# EAGLE schematic cpu_board (EAGLE 7.2.0)
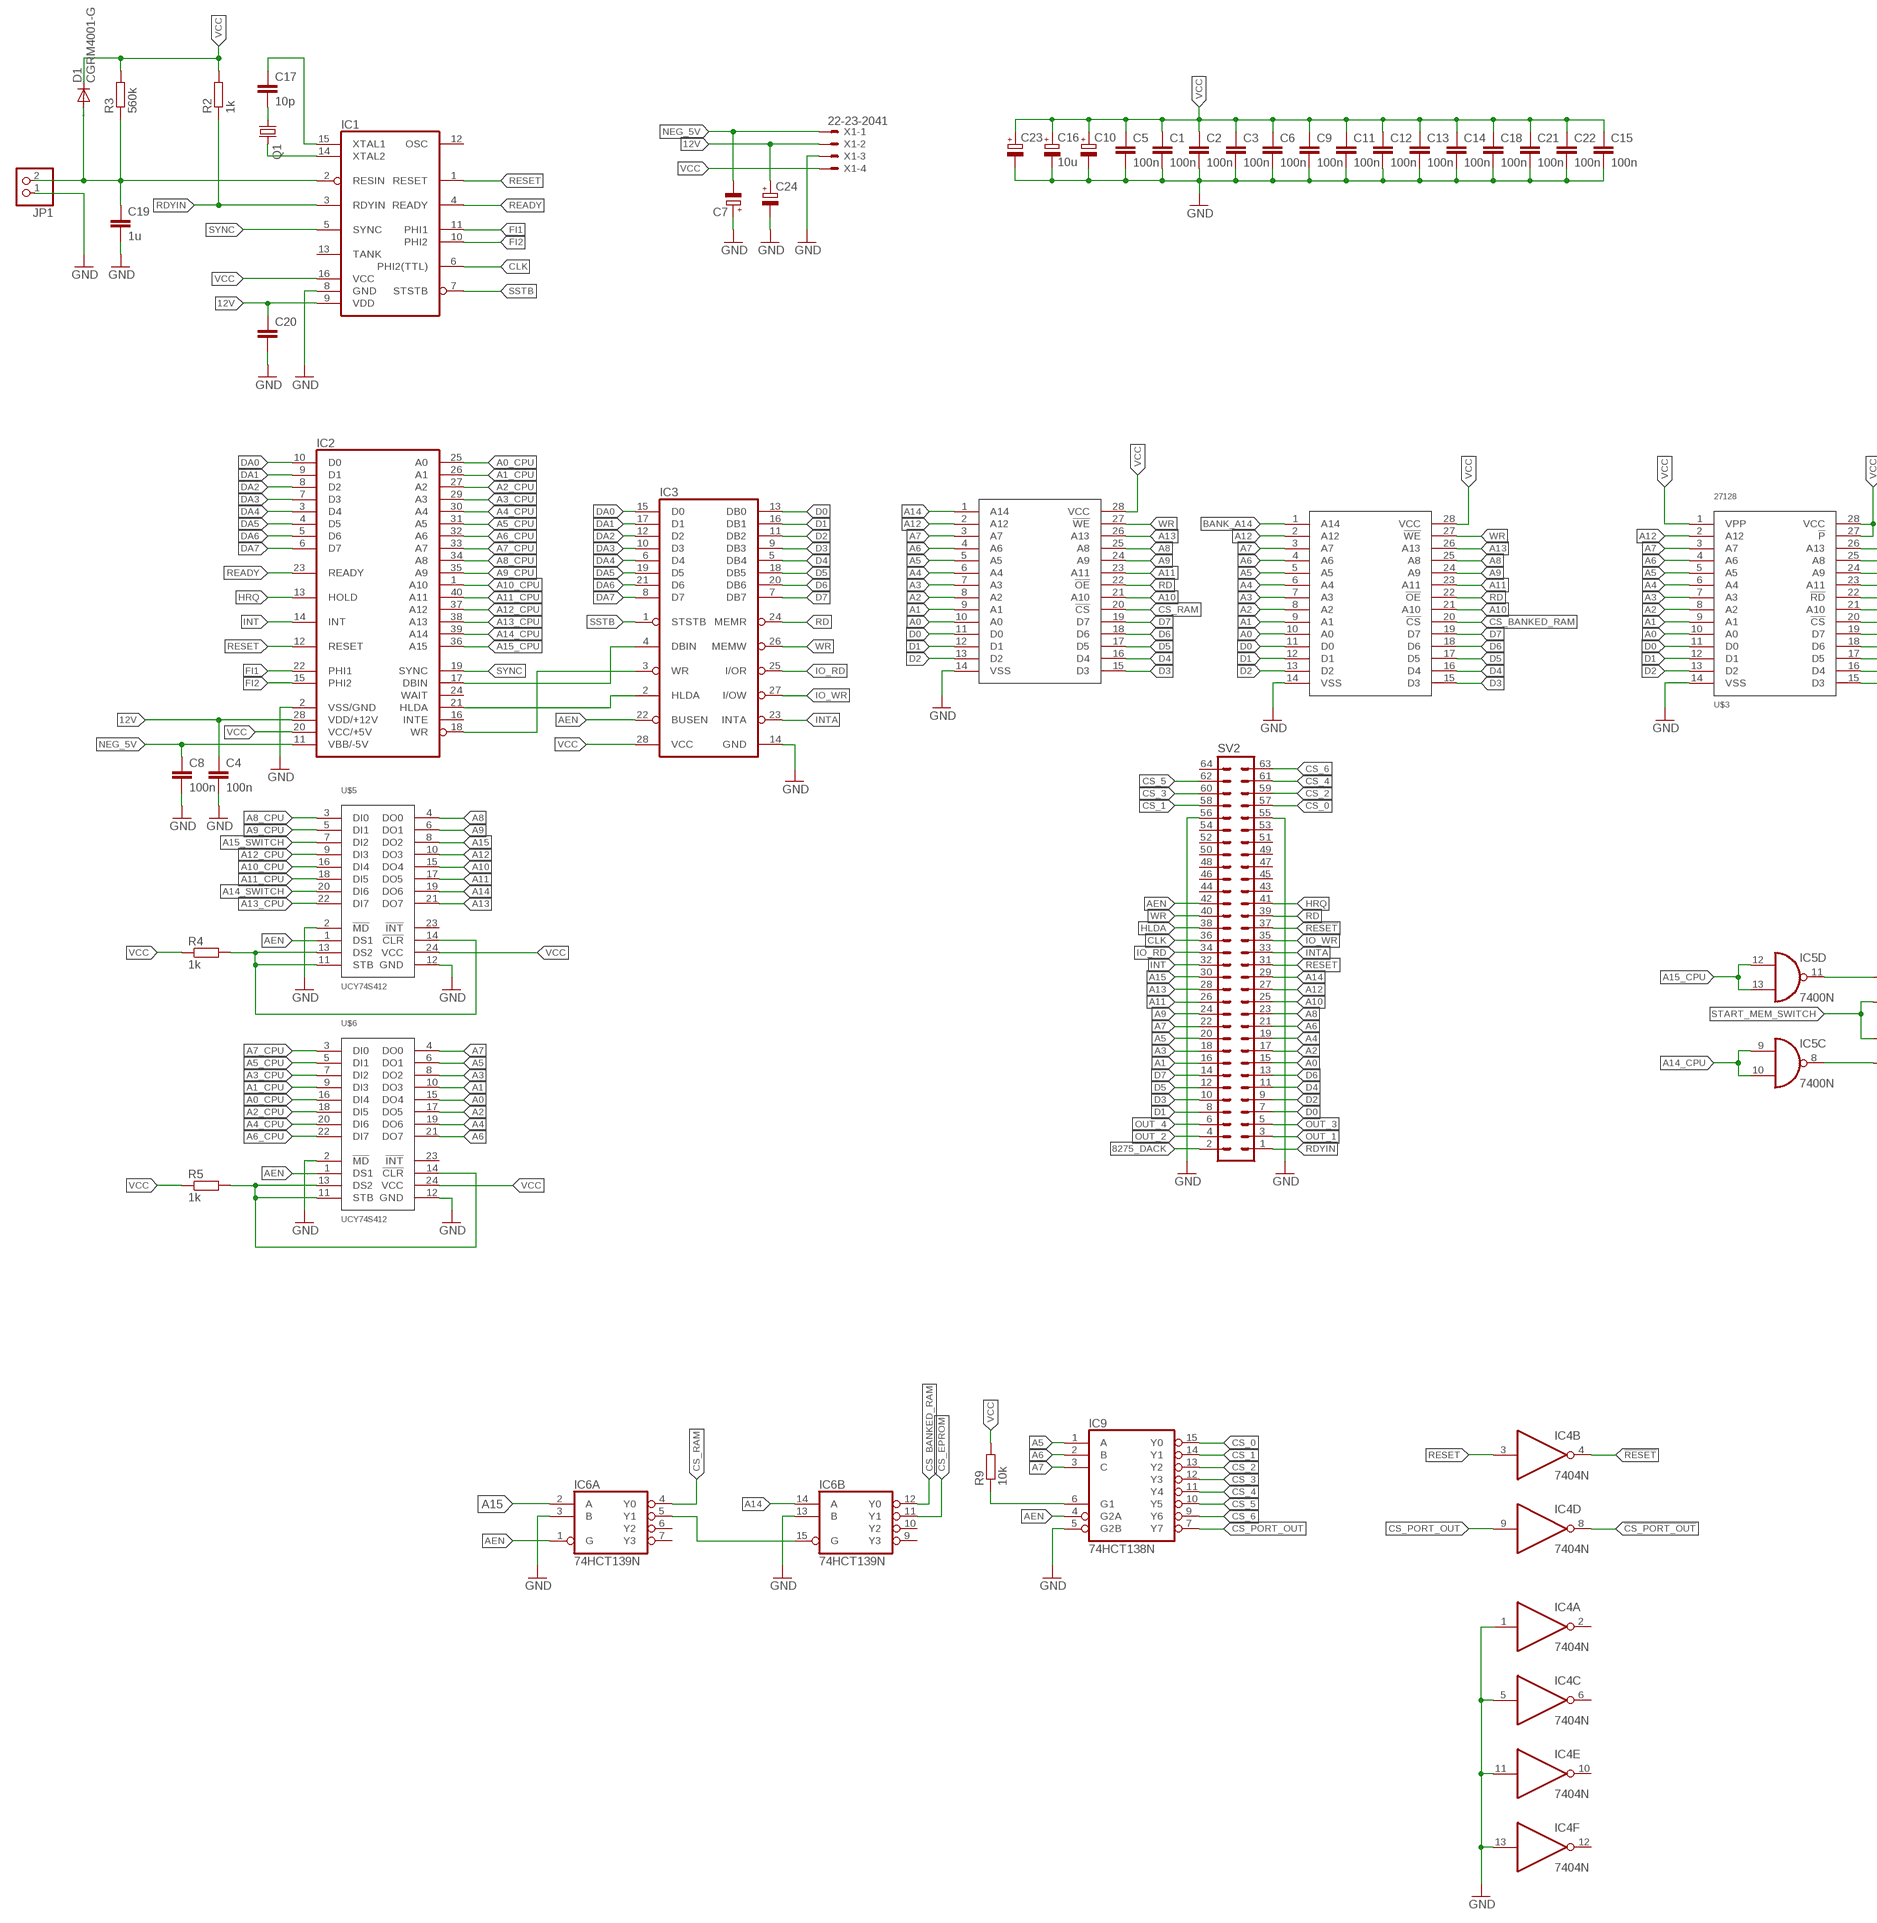
[diagram p0: schematic, sheet 1, part 1 of 2]
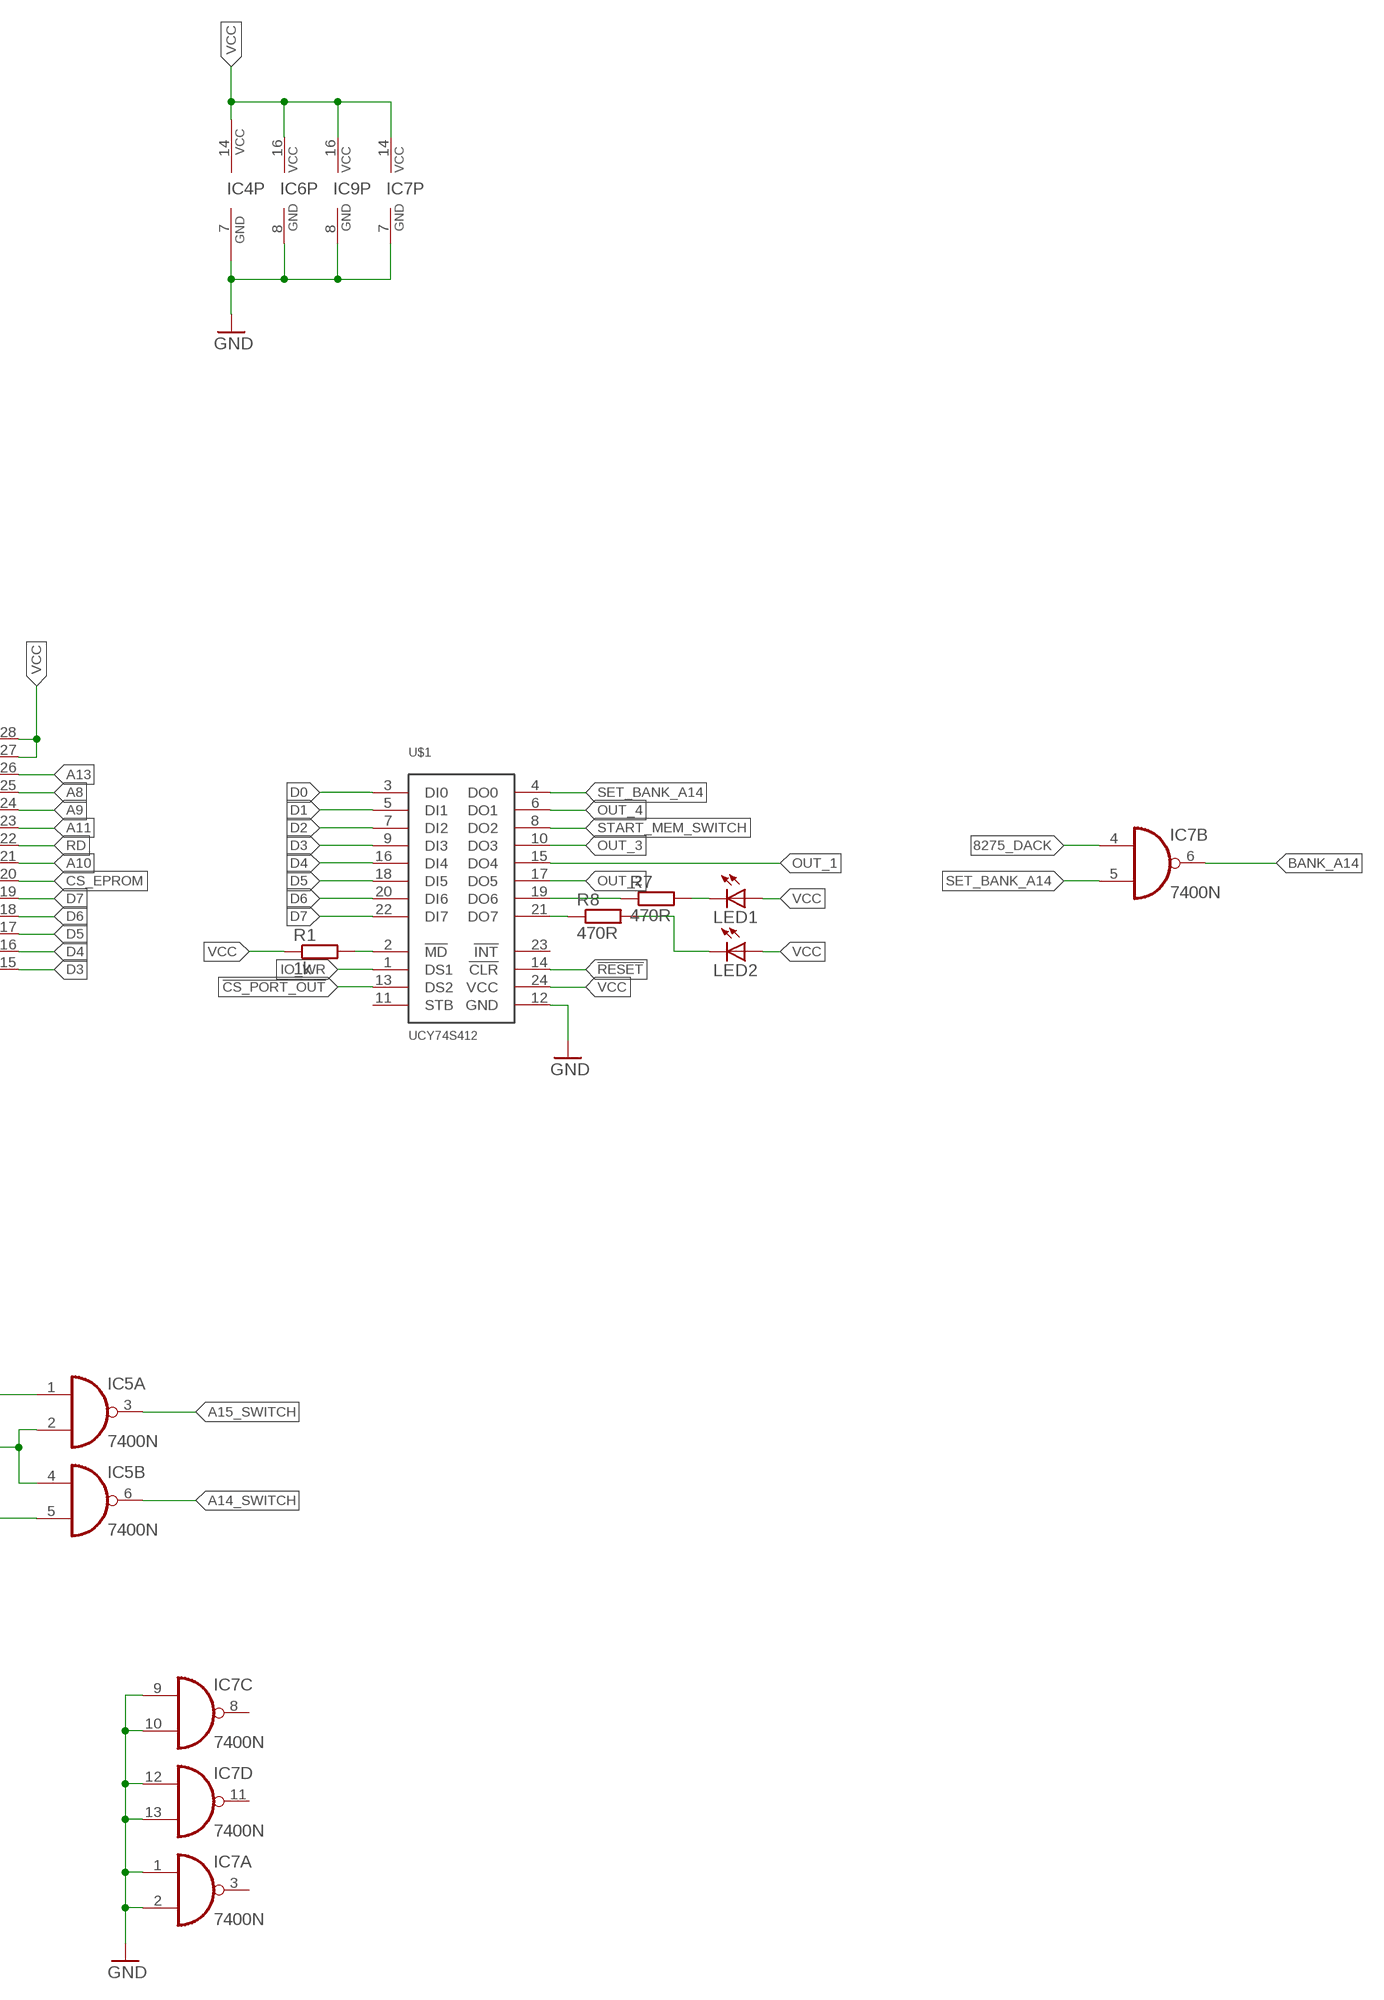
[diagram p1: schematic, sheet 1, part 2 of 2]

## Parts
C1  100n  C-EUC1206  [C1206]
C2  100n  C-EUC1206  [C1206]
C3  100n  C-EUC1206  [C1206]
C4  100n  C-EUC1206  [C1206]
C5  100n  C-EUC0603  [C0603]
C6  100n  C-EUC1206  [C1206]
C7  CPOL-EUE2.5-7  [E2,5-7]
C8  100n  C-EUC1206  [C1206]
C9  100n  C-EUC1206  [C1206]
C10  CPOL-EUE5-10.5  [E5-10,5]
C11  100n  C-EUC0805  [C0805]
C12  100n  C-EUC0805  [C0805]
C13  100n  C-EUC0805  [C0805]
C14  100n  C-EUC1206  [C1206]
C15  100n  C-EUC1206  [C1206]
C16  10u  CPOL-EUSMCB  [SMC_B]
C17  10p  C-EUC0603  [C0603]
C18  100n  C-EUC0603  [C0603]
C19  1u  C-EUC0603  [C0603]
C20  C-EUC0603  [C0603]
C21  100n  C-EUC1206  [C1206]
C22  100n  C-EUC0603  [C0603]
C23  CPOL-EUE5-10.5  [E5-10,5]
C24  CPOL-EUE3.5-8  [E3,5-8]
D1  CGRM4001-G  [SOD-123_MINI-SMA]
IC1  8224  [DIL16]
IC2  8080  [DIL40]
IC3  8228  [DIL28-6]
IC4  7404N  [DIL14]
IC5  7400N  [DIL14]
IC6  74HCT139N  [DIL16]
IC7  7400N  [DIL14]
IC9  74HCT138N  [DIL16]
JP1  PINHD-1X2  [1X02]
LED1  LED3MM  [LED3MM]
LED2  LED3MM  [LED3MM]
Q1  CRYSTALHC49U-V  [HC49U-V]
R1  1k  R-EU_M1206  [M1206]
R2  1k  R-EU_R0603  [R0603]
R3  560k  R-EU_R0603  [R0603]
R4  1k  R-EU_R0603  [R0603]
R5  1k  R-EU_0204/7  [0204/7]
R7  470R  R-EU_R0603  [R0603]
R8  470R  R-EU_R0603  [R0603]
R9  10k  R-EU_R0603  [R0603]
SV2  ML64L  [ML64L]
U$1  UCY74S412  [DIL24-6]
U$2  62256  [DIL28-6]
U$3  27128  [DIL28]
U$4  62256  [DIL28-6]
U$5  UCY74S412  [DIL24-6]
U$6  UCY74S412  [DIL24-6]
X1  22-23-2041  [22-23-2041]

## Nets
12V: C4.1 C20.1 C24.+ IC1.9(VDD) IC2.28(VDD/+12V) X1.2
8275_DACK: IC7.4(B:I0) SV2.2
!CS_PORT_OUT: IC4.8(D:O) U$1.13(DS2)
!RESET: IC4.4(B:O) SV2.37 U$1.14(!CLR)
A0: SV2.15 U$2.10(A0) U$3.10(A0) U$4.10(A0) U$6.15(DO4)
A0_CPU: IC2.25(A0) U$6.16(DI4)
A1: SV2.16 U$2.9(A1) U$3.9(A1) U$4.9(A1) U$6.10(DO3)
A1_CPU: IC2.26(A1) U$6.9(DI3)
A2: SV2.17 U$2.8(A2) U$3.8(A2) U$4.8(A2) U$6.17(DO5)
A2_CPU: IC2.27(A2) U$6.18(DI5)
A3: SV2.18 U$2.7(A3) U$3.7(A3) U$4.7(A3) U$6.8(DO2)
A3_CPU: IC2.29(A3) U$6.7(DI2)
A4: SV2.19 U$2.6(A4) U$3.6(A4) U$4.6(A4) U$6.19(DO6)
A4_CPU: IC2.30(A4) U$6.20(DI6)
A5: IC9.1(A) SV2.20 U$2.5(A5) U$3.5(A5) U$4.5(A5) U$6.6(DO1)
A5_CPU: IC2.31(A5) U$6.5(DI1)
A6: IC9.2(B) SV2.21 U$2.4(A6) U$3.4(A6) U$4.4(A6) U$6.21(DO7)
A6_CPU: IC2.32(A6) U$6.22(DI7)
A7: IC9.3(C) SV2.22 U$2.3(A7) U$3.3(A7) U$4.3(A7) U$6.4(DO0)
A7_CPU: IC2.33(A7) U$6.3(DI0)
A8: SV2.23 U$2.25(A8) U$3.25(A8) U$4.25(A8) U$5.4(DO0)
A8_CPU: IC2.34(A8) U$5.3(DI0)
A9: SV2.24 U$2.24(A9) U$3.24(A9) U$4.24(A9) U$5.6(DO1)
A9_CPU: IC2.35(A9) U$5.5(DI1)
A10: SV2.25 U$2.21(A10) U$3.21(A10) U$4.21(A10) U$5.15(DO4)
A10_CPU: IC2.1(A10) U$5.16(DI4)
A11: SV2.26 U$2.23(A11) U$3.23(A11) U$4.23(A11) U$5.17(DO5)
A11_CPU: IC2.40(A11) U$5.18(DI5)
A12: SV2.27 U$2.2(A12) U$3.2(A12) U$4.2(A12) U$5.10(DO3)
A12_CPU: IC2.37(A12) U$5.9(DI3)
A13: SV2.28 U$2.26(A13) U$3.26(A13) U$4.26(A13) U$5.21(DO7)
A13_CPU: IC2.38(A13) U$5.22(DI7)
A14: IC6.14(B:A) SV2.29 U$4.1(A14) U$5.19(DO6)
A14_CPU: IC2.39(A14) IC5.9(C:I0) IC5.10(C:I1)
A14_SWITCH: IC5.6(B:O) U$5.20(DI6)
A15: IC6.2(A:A) SV2.30 U$5.8(DO2)
A15_CPU: IC2.36(A15) IC5.12(D:I0) IC5.13(D:I1)
A15_SWITCH: IC5.3(A:O) U$5.7(DI2)
AEN: IC3.22(BUSEN) IC6.1(A:G) IC9.4(G2A) SV2.42 U$5.1(DS1) U$6.1(DS1)
BANK_A14: IC7.6(B:O) U$2.1(A14)
CLK: IC1.6(PHI2(TTL)) SV2.36
CS_0: IC9.15(Y0) SV2.57
CS_1: IC9.14(Y1) SV2.58
CS_2: IC9.13(Y2) SV2.59
CS_3: IC9.12(Y3) SV2.60
CS_4: IC9.11(Y4) SV2.61
CS_5: IC9.10(Y5) SV2.62
CS_6: IC9.9(Y6) SV2.63
CS_BANKED_RAM: IC6.12(B:Y0) U$2.20(!CS)
CS_EPROM: IC6.11(B:Y1) U$3.20(!CS)
CS_PORT_OUT: IC4.9(D:I) IC9.7(Y7)
CS_RAM: IC6.4(A:Y0) U$4.20(!CS)
D0: IC3.13(DB0) SV2.7 U$1.3(DI0) U$2.11(D0) U$3.11(D0) U$4.11(D0)
D1: IC3.16(DB1) SV2.8 U$1.5(DI1) U$2.12(D1) U$3.12(D1) U$4.12(D1)
D2: IC3.11(DB2) SV2.9 U$1.7(DI2) U$2.13(D2) U$3.13(D2) U$4.13(D2)
D3: IC3.9(DB3) SV2.10 U$1.9(DI3) U$2.15(D3) U$3.15(D3) U$4.15(D3)
D4: IC3.5(DB4) SV2.11 U$1.16(DI4) U$2.16(D4) U$3.16(D4) U$4.16(D4)
D5: IC3.18(DB5) SV2.12 U$1.18(DI5) U$2.17(D5) U$3.17(D5) U$4.17(D5)
D6: IC3.20(DB6) SV2.13 U$1.20(DI6) U$2.18(D6) U$3.18(D6) U$4.18(D6)
D7: IC3.7(DB7) SV2.14 U$1.22(DI7) U$2.19(D7) U$3.19(D7) U$4.19(D7)
DA0: IC2.10(D0) IC3.15(D0)
DA1: IC2.9(D1) IC3.17(D1)
DA2: IC2.8(D2) IC3.12(D2)
DA3: IC2.7(D3) IC3.10(D3)
DA4: IC2.3(D4) IC3.6(D4)
DA5: IC2.4(D5) IC3.19(D5)
DA6: IC2.5(D6) IC3.21(D6)
DA7: IC2.6(D7) IC3.8(D7)
FI1: IC1.11(PHI1) IC2.22(PHI1)
FI2: IC1.10(PHI2) IC2.15(PHI2)
GND: C1.2 C2.2 C3.2 C4.2 C5.2 C6.2 C7.+ C8.2 C9.2 C10.- C11.2 C12.2 C13.2 C14.2 C15.2 C16.- C18.2 C19.2 C20.2 C21.2 C22.2 C23.- C24.- IC1.8(GND) IC2.2(VSS/GND) IC3.14(GND) IC4.1(A:I) IC4.5(C:I) IC4.7(P:GND) IC4.11(E:I) IC4.13(F:I) IC6.3(A:B) IC6.8(P:GND) IC6.13(B:B) IC7.1(A:I0) IC7.2(A:I1) IC7.7(P:GND) IC7.9(C:I0) IC7.10(C:I1) IC7.12(D:I0) IC7.13(D:I1) IC9.5(G2B) IC9.8(GND) JP1.1 SV2.55 SV2.56 U$1.12(GND) U$2.14(VSS) U$3.14(VSS) U$4.14(VSS) U$5.2(!MD) U$5.12(GND) U$6.2(!MD) U$6.12(GND) X1.3
HLDA: IC2.21(HLDA) IC3.2(HLDA) SV2.38
HRQ: IC2.13(HOLD) SV2.41
INT: IC2.14(INT) SV2.32
INTA: IC3.23(INTA) SV2.33
IO_RD: IC3.25(I/OR) SV2.34
IO_WR: IC3.27(I/OW) SV2.35 U$1.1(DS1)
N$1: IC2.17(DBIN) IC3.4(DBIN)
N$3: R7.1 U$1.19(DO6)
N$4: LED1.K(C) R7.2
N$5: IC2.18(WR) IC3.3(WR)
N$6: R8.1 U$1.21(DO7)
N$7: R1.2 U$1.2(!MD)
N$9: IC1.14(XTAL2) Q1.2
N$10: C17.2 Q1.1
N$11: C17.1 IC1.15(XTAL1)
N$12: C19.1 D1.A IC1.2(RESIN) JP1.2 R3.1
N$13: R5.2 U$6.11(STB) U$6.13(DS2) U$6.14(!CLR)
N$15: R4.2 U$5.11(STB) U$5.13(DS2) U$5.14(!CLR)
N$17: LED2.K(C) R8.2
N$19: IC6.5(A:Y1) IC6.15(B:G)
N$20: IC9.6(G1) R9.1
N$21: IC5.5(B:I1) IC5.8(C:O)
N$26: IC5.1(A:I0) IC5.11(D:O)
NEG_5V: C7.- C8.1 IC2.11(VBB/-5V) X1.1
OUT_1: SV2.3 U$1.15(DO4)
OUT_2: SV2.4 U$1.17(DO5)
OUT_3: SV2.5 U$1.10(DO3)
OUT_4: SV2.6 U$1.6(DO1)
RD: IC3.24(MEMR) SV2.39 U$2.22(!OE) U$3.22(!RD) U$4.22(!OE)
RDYIN: IC1.3(RDYIN) R2.1 SV2.1
READY: IC1.4(READY) IC2.23(READY)
RESET: IC1.1(RESET) IC2.12(RESET) IC4.3(B:I) SV2.31
SET_BANK_A14: IC7.5(B:I1) U$1.4(DO0)
SSTB: IC1.7(STSTB) IC3.1(STSTB)
START_MEM_SWITCH: IC5.2(A:I1) IC5.4(B:I0) U$1.8(DO2)
SYNC: IC1.5(SYNC) IC2.19(SYNC)
VCC: C1.1 C2.1 C3.1 C5.1 C6.1 C9.1 C10.+ C11.1 C12.1 C13.1 C14.1 C15.1 C16.+ C18.1 C21.1 C22.1 C23.+ D1.C IC1.16(VCC) IC2.20(VCC/+5V) IC3.28(VCC) IC4.14(P:VCC) IC6.16(P:VCC) IC7.14(P:VCC) IC9.16(VCC) LED1.A LED2.A R1.1 R2.2 R3.2 R4.1 R5.1 R9.2 U$1.24(VCC) U$2.28(VCC) U$3.1(VPP) U$3.27(!P) U$3.28(VCC) U$4.28(VCC) U$5.24(VCC) U$6.24(VCC) X1.4
WR: IC3.26(MEMW) SV2.40 U$2.27(!WE) U$4.27(!WE)
Unconnected: IC1.12(OSC) IC1.13(TANK) IC2.16(INTE) IC2.24(WAIT) IC4.2(A:O) IC4.6(C:O) IC4.10(E:O) IC4.12(F:O) IC6.6(A:Y2) IC6.7(A:Y3) IC6.9(B:Y3) IC6.10(B:Y2) IC7.3(A:O) IC7.8(C:O) IC7.11(D:O) SV2.43 SV2.44 SV2.45 SV2.46 SV2.47 SV2.48 SV2.49 SV2.50 SV2.51 SV2.52 SV2.53 SV2.54 SV2.64 U$1.11(STB) U$1.23(!INT) U$5.23(!INT) U$6.23(!INT)

## Power pins joined to a net without a drawn wire
GND: IC5.7(P:GND)
VCC: IC5.14(P:VCC)

## Library data of the parts
C1-C6 C8 C9 C11-C15 C17-C22 = rcl:C-EU: CAPACITOR, European symbol
C7 C10 C16 C23 C24 = rcl:CPOL-EU: POLARIZED CAPACITOR, European symbol
D1 = diode:CGRM400*-G: Molded plasitc,JEDEC SOD-123/Mini SMA Source: Comchip CGRM4001-G.pdf
IC1 = micro-intel:8224: MICROCOMPUTER/PERIPHERAL DEVICE; OC_FARNELL: unknown; OC_NEWARK: unknown
IC2 = micro-intel:8080: MICROCOMPUTER/PERIPHERAL DEVICE; OC_FARNELL: unknown; OC_NEWARK: unknown
IC3 = micro-intel:8228: MICROCOMPUTER/PERIPHERAL DEVICE; OC_FARNELL: unknown; OC_NEWARK: unknown
IC4 = 74xx-us:74*04: Hex INVERTER
IC5 IC7 = 74xx-eu:74*00: Quad 2-input NAND gate
IC6 = 74xx-eu:74*139: Dual 2-line to 4-line DECODER/DEMULTIPLEXER
IC9 = 74xx-eu:74*138: 3-line to 8-line DECODER/DEMULTIPLEXER
JP1 = pinhead:PINHD-1X2: PIN HEADER
LED1 LED2 = led:LED: LED OSRAM: - CHIPLED LG R971, LG N971, LY N971, LG Q971, LY Q971, LO R971, LY R971 LH N974, LH R974 LS Q976, LO Q976, LY Q976 LO Q996 - Hyper CHIPLED LW Q18S LB Q993, LB Q99A, LB R99A - SideLED LS A670, LO A670, LY A670, LG A670, LP A670 LB A673, LV A673, LT A673, LW A673 LH A674 LY A675 LS A676, LA A676, LO A676, LY A676, LW A676 LS A679, LY A679, LG A679 - Hyper Micro SIDELED® LS Y876, LA Y876, LO Y876, LY Y876 LT Y87S - SmartLED LW L88C, LW L88S LB L89C, LB L89S, LG L890 LS L89K, LO L89K, LY L89K LS L896, LA L896, LO L896, LY L896 - TOPLED LS T670, LO T670, LY T670, LG T670, LP T670 LSG T670, LSP T670, LSY T670, LOP T670, LYG T670 LG T671, LOG T671, LSG T671 LB T673, LV T673, LT T673, LW T673 LH T674 LS T676, LA T676, LO T676, LY T676, LB T676, LH T676, LSB T676, LW T676 LB T67C, LV T67C, LT T67C, LS T67K, LO T67K, LY T67K, LW E67C LS E67B, LA E67B, LO E67B, LY E67B, LB E67C, LV E67C, LT E67C LW T67C LS T679, LY T679, LG T679 LS T770, LO T770, LY T770, LG T770, LP T770 LB T773, LV T773, LT T773, LW T773 LH T774 LS E675, LA E675, LY E675, LS T675 LS T776, LA T776, LO T776, LY T776, LB T776 LHGB T686 LT T68C, LB T68C - Hyper Mini TOPLED® LB M676 - Mini TOPLED Santana® LG M470 LS M47K, LO M47K, LY M47K Source: http://www.osram.convergy.de LUXEON: - LUMILED® LXK2-PW12-R00, LXK2-PW12-S00, LXK2-PW14-U00, LXK2-PW14-V00 LXK2-PM12-R00, LXK2-PM12-S00, LXK2-PM14-U00 LXK2-PE12-Q00, LXK2-PE12-R00, LXK2-PE12-S00, LXK2-PE14-T00, LXK2-PE14-U00 LXK2-PB12-K00, LXK2-PB12-L00, LXK2-PB12-M00, LXK2-PB14-N00, LXK2-PB14-P00, LXK2-PB14-Q00 LXK2-PR12-L00, LXK2-PR12-M00, LXK2-PR14-Q00, LXK2-PR14-R00 LXK2-PD12-Q00, LXK2-PD12-R00, LXK2-PD12-S00 LXK2-PH12-R00, LXK2-PH12-S00 LXK2-PL12-P00, LXK2-PL12-Q00, LXK2-PL12-R00 Source: www.luxeon.com KINGBRIGHT: KA-3528ASYC Source: www.kingbright.com
Q1 = crystal:CRYSTAL: CRYSTAL; OC_FARNELL: 1666969; OC_NEWARK: unknown
R1-R5 R7-R9 = rcl:R-EU_: RESISTOR, European symbol
SV2 = con-harting-ml:ML64: HARTING; OC_FARNELL: unknown; OC_NEWARK: unknown
U$1 U$5 U$6 = mw:UCY74S412
U$2 U$4 = memory-sram:62256
U$3 = mw:27128
X1 = con-molex:22-23-2041: .100" (2.54mm) Center Header - 4 Pin; MF: MOLEX; MPN: 22-23-2041; OC_FARNELL: 1462920; OC_NEWARK: 38C0355